# EAGLE schematic LED Schematic Final (EAGLE 9.2.0)
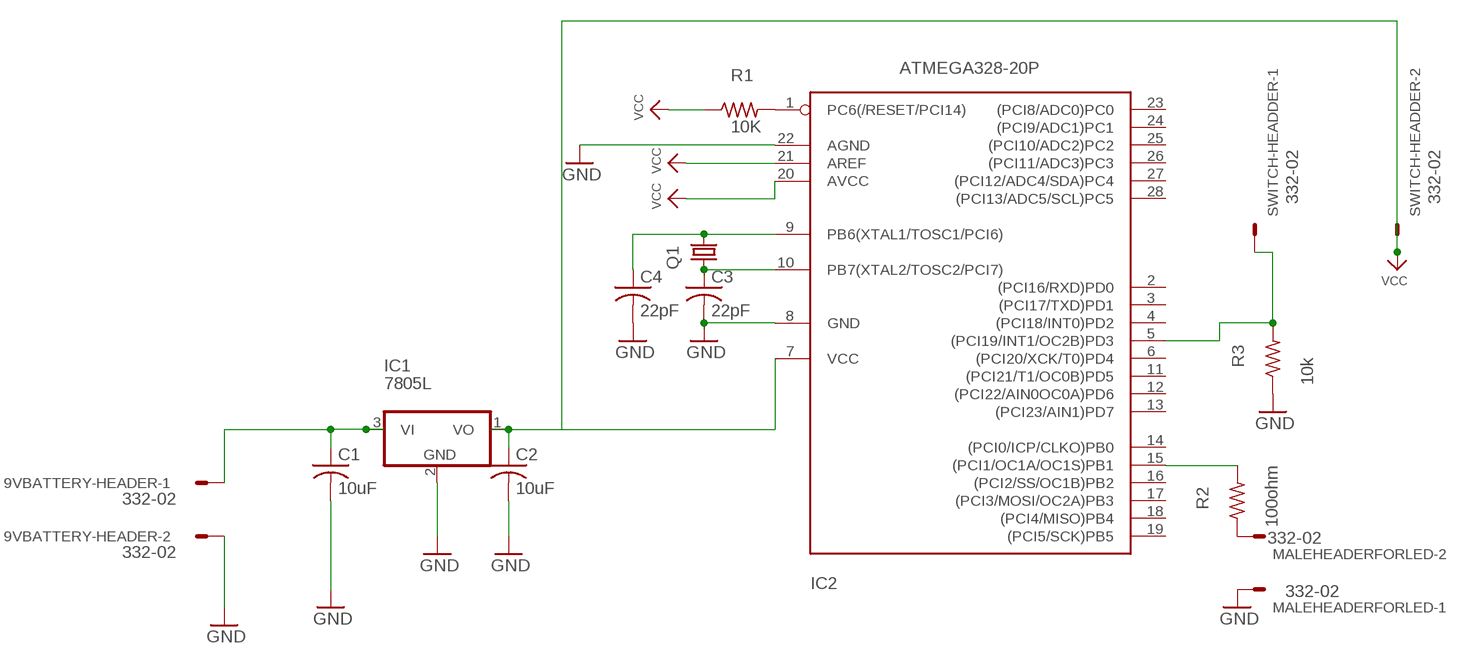
[diagram p0: schematic, sheet 1]

## Parts
9VBATTERY-HEADER  332-02  [332-02]
C1  10uF  C-US025-040X050  [C025-040X050]
C2  10uF  C-US025-040X050  [C025-040X050]
C3  22pF  C-US025-040X050  [C025-040X050]
C4  22pF  C-US025-040X050  [C025-040X050]
IC1  7805L  [TO92]
IC2  ATMEGA328-20P  [DIL28-3]
MALEHEADERFORLED  332-02  [332-02]
Q1  CRYSTALHC49S  [HC49/S]
R1  10K  R-US_0207/12  [0207/12]
R2  100ohm  R-US_0207/12  [0207/12]
R3  10k  R-US_0207/12  [0207/12]
SWITCH-HEADDER  332-02  [332-02]

## Nets
GND: 9VBATTERY-HEADER.2 C1.2 C2.2 C3.2 C4.2 IC1.2(GND) IC2.8(GND) IC2.22(AGND) MALEHEADERFORLED.1 R3.1
N$1: IC2.1(PC6(/RESET/PCI14)) R1.2
N$2: C4.1 IC2.9(PB6(XTAL1/TOSC1/PCI6)) Q1.2
N$3: C3.1 IC2.10(PB7(XTAL2/TOSC2/PCI7)) Q1.1
N$4: 9VBATTERY-HEADER.1 C1.1 IC1.3(VI)
N$7: IC2.15((PCI1/OC1A/OC1S)PB1) R2.2
N$8: MALEHEADERFORLED.2 R2.1
N$9: IC2.5((PCI19/INT1/OC2B)PD3) R3.2 SWITCH-HEADDER.1
VCC: C2.1 IC1.1(VO) IC2.7(VCC) IC2.20(AVCC) IC2.21(AREF) R1.1 SWITCH-HEADDER.2
Unconnected: IC2.2((PCI16/RXD)PD0) IC2.3((PCI17/TXD)PD1) IC2.4((PCI18/INT0)PD2) IC2.6((PCI20/XCK/T0)PD4) IC2.11((PCI21/T1/OC0B)PD5) IC2.12((PCI22/AIN0OC0A)PD6) IC2.13((PCI23/AIN1)PD7) IC2.14((PCI0/ICP/CLKO)PB0) IC2.16((PCI2/SS/OC1B)PB2) IC2.17((PCI3/MOSI/OC2A)PB3) IC2.18((PCI4/MISO)PB4) IC2.19((PCI5/SCK)PB5) IC2.23((PCI8/ADC0)PC0) IC2.24((PCI9/ADC1)PC1) IC2.25((PCI10/ADC2)PC2) IC2.26((PCI11/ADC3)PC3) IC2.27((PCI12/ADC4/SDA)PC4) IC2.28((PCI13/ADC5/SCL)PC5)

## Library data of the parts
9VBATTERY-HEADER MALEHEADERFORLED SWITCH-HEADDER = con-garry:332-02: 2 Pin - 2mm Dual Row Source: www.mpe-connector.de / garry_shortform_2012.pdf
C1-C4 = adafruit:C-US: CAPACITOR, American symbol
IC1 = adafruit:78*: Positive VOLTAGE REGULATOR Added bigger pads to the TO-92 package
IC2 = atmega328:ATMEGA328*P: MICROCONTROLLER 32 kBytes FLASH 2 kBytes SRAM 1 kBytes EEPROM USART 8-channel 10 bit ADC
Q1 = adafruit:CRYSTAL: CRYSTAL; OC_FARNELL: 1667008; OC_NEWARK: unknown
R1 R2 = adafruit:R-US_: RESISTOR, American symbol
R3 = adafruit:R-US_: RESISTOR, American symbol; SPICEPREFIX: R

## Net classes
0 default: width 0.508 mm, clearance 0.508 mm